# EAGLE schematic idtsram (EAGLE 6.4)
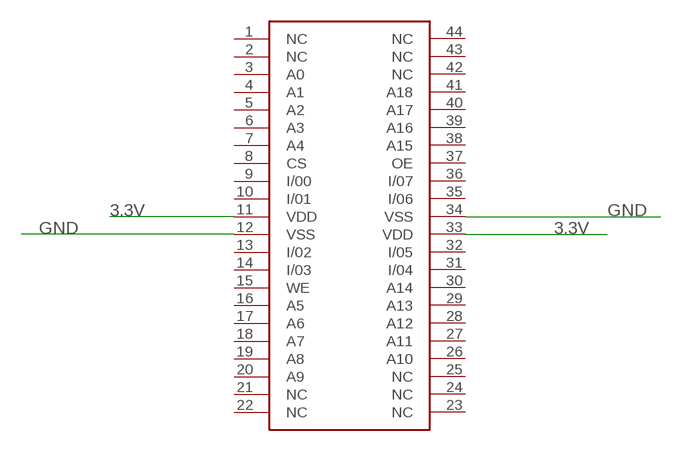
[diagram p0: schematic, sheet 1]

## Parts
U$1  IDT71V424S15PHGI8  [TSOP44-T2]

## Nets
3.3V: U$1.11(VDD) U$1.33(VDD)
GND: U$1.12(VSS) U$1.34(VSS)
Unconnected: U$1.1(NC) U$1.2(NC) U$1.3(A0) U$1.4(A1) U$1.5(A2) U$1.6(A3) U$1.7(A4) U$1.8(CS) U$1.9(I/00) U$1.10(I/01) U$1.13(I/02) U$1.14(I/03) U$1.15(WE) U$1.16(A5) U$1.17(A6) U$1.18(A7) U$1.19(A8) U$1.20(A9) U$1.21(NC) U$1.22(NC) U$1.23(NC) U$1.24(NC) U$1.25(NC) U$1.26(A10) U$1.27(A11) U$1.28(A12) U$1.29(A13) U$1.30(A14) U$1.31(I/04) U$1.32(I/05) U$1.35(I/06) U$1.36(I/07) U$1.37(OE) U$1.38(A15) U$1.39(A16) U$1.40(A17) U$1.41(A18) U$1.42(NC) U$1.43(NC) U$1.44(NC)

## Library data of the parts
U$1 = TSOP44-T2:IDT71V424S15PHGI8: IDT71V424S15PHGI8 3.3V CMOS Static RAM 4 Meg (512K x 8-Bit)